# EAGLE schematic BlueESC-Basic (EAGLE 7.1.0)
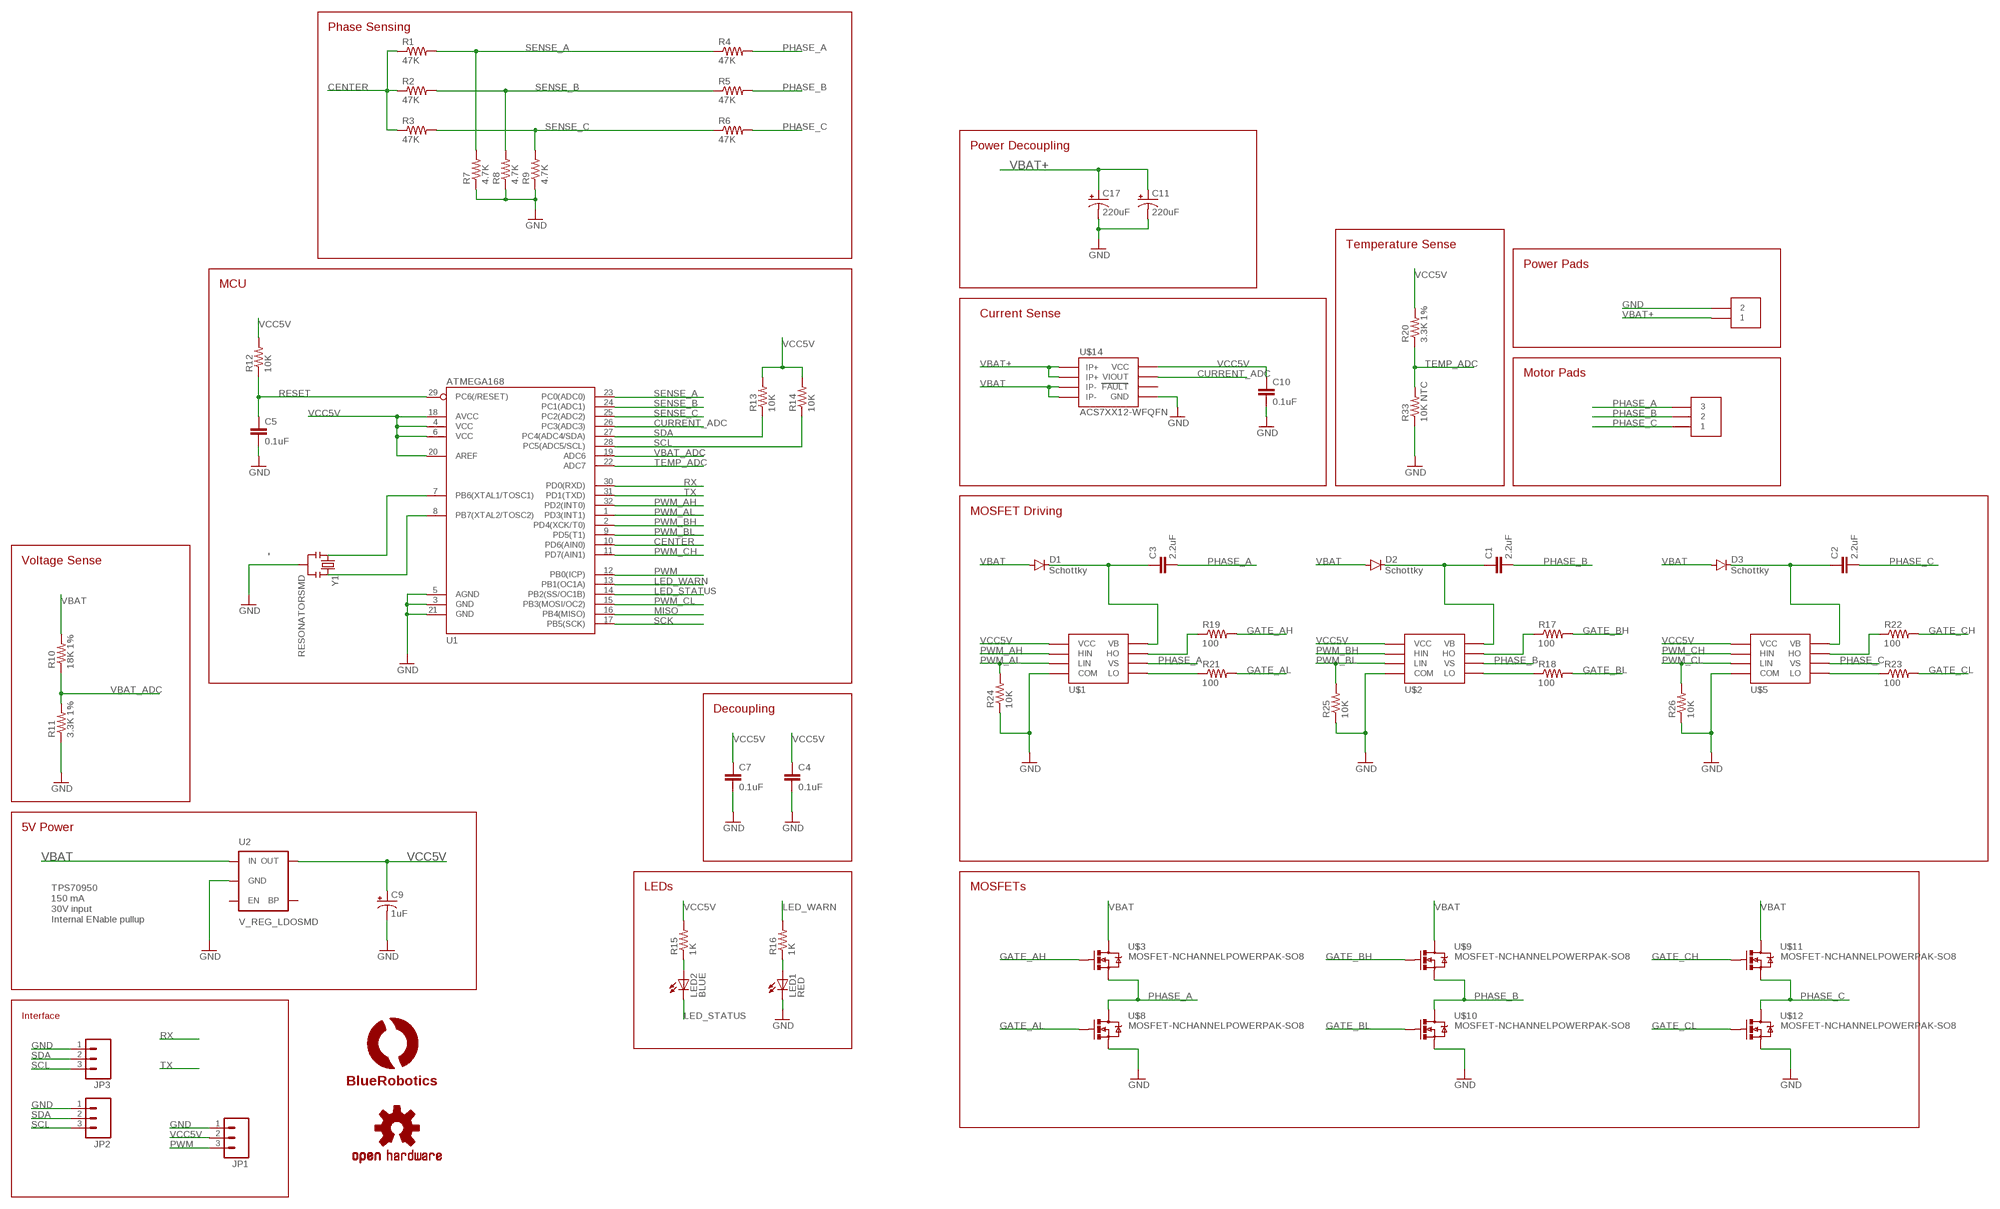
[diagram p0: schematic, sheet 1]

## Parts
C1  2.2uF  CAP0805  [0805]
C2  2.2uF  CAP0805  [0805]
C3  2.2uF  CAP0805  [0805]
C4  0.1uF  CAP0603-CAP  [0603-CAP]
C5  0.1uF  CAP0603-CAP  [0603-CAP]
C7  0.1uF  CAP0603-CAP  [0603-CAP]
C9  1uF  CAP_POL1206  [EIA3216]
C10  0.1uF  CAP0603-CAP  [0603-CAP]
C11  220uF  CAP_POLE  [PANASONIC_E]
C17  220uF  CAP_POLE  [PANASONIC_E]
D1  Schottky  DIODESOD  [SOD-323]
D2  Schottky  DIODESOD  [SOD-323]
D3  Schottky  DIODESOD  [SOD-323]
JP1  M03PTH  [1X03]
JP2  M03PTH  [1X03]
JP3  M03PTH  [1X03]
LED1  RED  LED0603  [LED-0603]
LED2  BLUE  LED0603  [LED-0603]
LOGO1  OSHW-LOGOS  [OSHW-LOGO-S]
R1  47K  33KOHM1/10W1%(0603)  [0603-RES]
R2  47K  33KOHM1/10W1%(0603)  [0603-RES]
R3  47K  33KOHM1/10W1%(0603)  [0603-RES]
R4  47K  33KOHM1/10W1%(0603)  [0603-RES]
R5  47K  33KOHM1/10W1%(0603)  [0603-RES]
R6  47K  33KOHM1/10W1%(0603)  [0603-RES]
R7  4.7K  RESISTOR0603  [0603-RES]
R8  4.7K  RESISTOR0603  [0603-RES]
R9  4.7K  RESISTOR0603  [0603-RES]
R10  18K 1%  33KOHM1/10W1%(0603)  [0603-RES]
R11  3.3K 1%  33KOHM1/10W1%(0603)  [0603-RES]
R12  10K  33KOHM1/10W1%(0603)  [0603-RES]
R13  10K  33KOHM1/10W1%(0603)  [0603-RES]
R14  10K  33KOHM1/10W1%(0603)  [0603-RES]
R15  1K  RESISTOR0603-RES  [0603-RES]
R16  1K  RESISTOR0603-RES  [0603-RES]
R17  100  33KOHM1/10W1%(0603)  [0603-RES]
R18  100  33KOHM1/10W1%(0603)  [0603-RES]
R19  100  33KOHM1/10W1%(0603)  [0603-RES]
R20  3.3K 1%  33KOHM1/10W1%(0603)  [0603-RES]
R21  100  33KOHM1/10W1%(0603)  [0603-RES]
R22  100  33KOHM1/10W1%(0603)  [0603-RES]
R23  100  33KOHM1/10W1%(0603)  [0603-RES]
R24  10K  33KOHM1/10W1%(0603)  [0603-RES]
R25  10K  33KOHM1/10W1%(0603)  [0603-RES]
R26  10K  33KOHM1/10W1%(0603)  [0603-RES]
R33  10K NTC  33KOHM1/10W1%(0603)  [0603-RES]
U1  ATMEGA168  [TQFP32-08]
U2  V_REG_LDOSMD  [SOT23-5]
U$1  IR2101SOIC8  [SOIC8]
U$2  IR2101SOIC8  [SOIC8]
U$3  MOSFET-NCHANNELPOWERPAK-SO8  [POWERPAK-SO8]
U$4  LOGOBR-LOGO-M  [BR-LOGO-MEDIUM]
U$5  IR2101SOIC8  [SOIC8]
U$8  MOSFET-NCHANNELPOWERPAK-SO8  [POWERPAK-SO8]
U$9  MOSFET-NCHANNELPOWERPAK-SO8  [POWERPAK-SO8]
U$10  MOSFET-NCHANNELPOWERPAK-SO8  [POWERPAK-SO8]
U$11  MOSFET-NCHANNELPOWERPAK-SO8  [POWERPAK-SO8]
U$12  MOSFET-NCHANNELPOWERPAK-SO8  [POWERPAK-SO8]
U$14  ACS7XX12-WFQFN  [12-WFQFN]
U$15  HEADER-2BARRIER-BLOCK-1  [OSTYK33102030]
U$16  HEADER-3BARRIER-BLOCK-1  [OSTYK33103030]
Y1  RESONATORSMD  [RESONATOR-SMD]

## Nets
CENTER: R1.1 R2.1 R3.1 U1.10(PD6(AIN0))
CURRENT_ADC: U1.26(PC3(ADC3)) U$14.VIOUT
GATE_AH: R19.2 U$3.4(G)
GATE_AL: R21.2 U$8.4(G)
GATE_BH: R17.2 U$9.4(G)
GATE_BL: R18.2 U$10.4(G)
GATE_CH: R22.2 U$11.4(G)
GATE_CL: R23.2 U$12.4(G)
GND: C4.2 C5.2 C7.2 C9.C(-) C10.2 C11.- C17.- JP2.1 JP3.1 LED1.C R7.1 R8.1 R9.1 R11.1 R24.1 R25.1 R26.1 R33.1 U1.3(GND) U1.5(AGND) U1.21(GND) U2.2(GND) U$1.4(COM) U$2.4(COM) U$5.4(COM) U$8.1(S) U$8.2(S) U$8.3(S) U$10.1(S) U$10.2(S) U$10.3(S) U$12.1(S) U$12.2(S) U$12.3(S) U$14.GND U$15.2 Y1.2
LED_STATUS: LED2.C U1.14(PB2(SS/OC1B))
LED_WARN: R16.2 U1.13(PB1(OC1A))
MISO: U1.16(PB4(MISO))
N$1: C1.1 D2.C U$2.8(VB)
N$2: R19.1 U$1.7(HO)
N$3: LED1.A R16.1
N$4: R21.1 U$1.5(LO)
N$5: R17.1 U$2.7(HO)
N$6: R18.1 U$2.5(LO)
N$7: C2.1 D3.C U$5.8(VB)
N$8: R22.1 U$5.7(HO)
N$9: R23.1 U$5.5(LO)
N$10: U1.7(PB6(XTAL1/TOSC1)) Y1.1
N$11: U1.8(PB7(XTAL2/TOSC2)) Y1.3
N$12: C3.1 D1.C U$1.8(VB)
N$16: LED2.A R15.1
PHASE_A: C3.2 R4.2 U$1.6(VS) U$3.1(S) U$3.2(S) U$3.3(S) U$8.5(D) U$8.6(D) U$8.7(D) U$8.8(D) U$8.9(D) U$16.3
PHASE_B: C1.2 R5.2 U$2.6(VS) U$9.1(S) U$9.2(S) U$9.3(S) U$10.5(D) U$10.6(D) U$10.7(D) U$10.8(D) U$10.9(D) U$16.2
PHASE_C: C2.2 R6.2 U$5.6(VS) U$11.1(S) U$11.2(S) U$11.3(S) U$12.5(D) U$12.6(D) U$12.7(D) U$12.8(D) U$12.9(D) U$16.1
PWM: U1.12(PB0(ICP))
PWM_AH: U1.32(PD2(INT0)) U$1.2(HIN)
PWM_AL: R24.2 U1.1(PD3(INT1)) U$1.3(LIN)
PWM_BH: U1.2(PD4(XCK/T0)) U$2.2(HIN)
PWM_BL: R25.2 U1.9(PD5(T1)) U$2.3(LIN)
PWM_CH: U1.11(PD7(AIN1)) U$5.2(HIN)
PWM_CL: R26.2 U1.15(PB3(MOSI/OC2)) U$5.3(LIN)
RESET: C5.1 R12.1 U1.29(PC6(/RESET))
RX: U1.30(PD0(RXD))
SCK: U1.17(PB5(SCK))
SCL: JP2.3 JP3.3 R14.1 U1.28(PC5(ADC5/SCL))
SDA: JP2.2 JP3.2 R13.1 U1.27(PC4(ADC4/SDA))
SENSE_A: R1.2 R4.1 R7.2 U1.23(PC0(ADC0))
SENSE_B: R2.2 R5.1 R8.2 U1.24(PC1(ADC1))
SENSE_C: R3.2 R6.1 R9.2 U1.25(PC2(ADC2))
TEMP_ADC: R20.1 R33.2 U1.22(ADC7)
TX: U1.31(PD1(TXD))
VBAT: D1.A D2.A D3.A R10.2 U2.1(IN) U$3.5(D) U$3.6(D) U$3.7(D) U$3.8(D) U$3.9(D) U$9.5(D) U$9.6(D) U$9.7(D) U$9.8(D) U$9.9(D) U$11.5(D) U$11.6(D) U$11.7(D) U$11.8(D) U$11.9(D) U$14.IP-1 U$14.IP-2
VBAT+: C11.+ C17.+ U$14.IP+1 U$14.IP+2 U$15.1
VBAT_ADC: R10.1 R11.2 U1.19(ADC6)
VCC5V: C4.1 C7.1 C9.A(+) C10.1 R12.2 R13.2 R14.2 R15.2 R20.2 U1.4(VCC) U1.6(VCC) U1.18(AVCC) U1.20(AREF) U2.5(OUT) U$1.1(VCC) U$2.1(VCC) U$5.1(VCC) U$14.VCC
Unconnected: JP1.1 JP1.2 JP1.3 U2.3(EN) U2.4(BP) U$14.FAULT

## Notes on the sheet
- Phase Sensing
- Power Decoupling
- Temperature Sense
- Power Pads
- MCU
- Current Sense
- Motor Pads
- MOSFET Driving
- Voltage Sense
- Decoupling
- 5V Power
- LEDs | MOSFETs
- TPS70950
  150 mA
  30V input
  Internal ENable pullup
- Interface

## Library data of the parts
C1-C5 C7 C10 = SparkFun-Capacitors:CAP: Capacitor Standard 0603 ceramic capacitor, and 0.1" leaded capacitor.
C9 C11 C17 = SparkFun-Capacitors:CAP_POL: Capacitor Polarized These are standard SMD and PTH capacitors. Normally 10uF, 47uF, and 100uF in electrolytic and tantalum varieties. Always verify the external diameter of the through hole cap, it varies with capacity, voltage, and manufacturer. The EIA devices should be standard.
D1-D3 = SparkFun-DiscreteSemi:DIODE: Diode These are standard reverse protection diodes and small signal diodes. SMA package can handle up to about 1A. SOD-323 can handle about 200mA. What the SOD-323 package when ordering, there are some mfgs out there that are 5-pin packages.; PROD_ID: DIO-09646
JP1-JP3 = SparkFun-Connectors:M03: Header 3 Standard 3-pin 0.1" header. Use with straight break away headers (SKU : PRT-00116), right angle break away headers (PRT-00553), swiss pins (PRT-00743), machine pins (PRT-00117), and female headers (PRT-00115). Molex polarized connector foot print use with SKU : PRT-08232 with associated crimp pins and housings.
LED1 LED2 = SparkFun:LED: LEDs Standard schematic elements and footprints for 5mm, 3mm, 1206, and 0603 sized LEDs. 5mm - Spark Fun Electronics SKU : COM-00529 (and others)
LOGO1 = SparkFun-Aesthetics:OSHW-LOGO: Open Source Hardware Logo This logo indicates the piece of hardware it is found on incorporates a OSHW license and/or adheres to the definition of open source hardware found here: http://freedomdefined.org/OSHW
R1-R6 R10-R14 R17-R26 R33 = SparkFun-Resistors:33KOHM1/10W1%(0603): RES-08416
R7-R9 = SparkFun-Resistors:RESISTOR: Resistor Basic schematic elements and footprints for 0603, 1206, and PTH resistors.
R15 R16 = SparkFun:RESISTOR: Resistor Basic schematic elements and footprints for 0603, 1206, and PTH resistors.
U1 = SparkFun-DigitalIC:ATMEGA168: Atmel 32-pin 8-bit micro, 16k flash.
U2 = SparkFun-PowerIC:V_REG_LDO: Voltage Regulator LDO Standard 150mA LDO voltage regulator in SOT-23 layout. Micrel part MIC5205. BP (by-pass) pin is used to lower output noise with 470pF cap.
U$1 U$2 U$5 = BR-Eagle-Library:IR2101
U$3 U$8-U$12 = BR-Eagle-Library:MOSFET-NCHANNEL
U$4 = BR-Eagle-Library:LOGO
U$14 = BR-Eagle-Library:ACS7XX
U$15 = BR-Eagle-Library:HEADER-2
U$16 = BR-Eagle-Library:HEADER-3
Y1 = SparkFun:RESONATOR: Resonator Small SMD resonator. This is the itty bitty 10/20MHz resonators with built in caps. CSTCE10M0G55 and CSTCE20M0V53. Footprint has been reviewed closely but hasn't been tested yet.